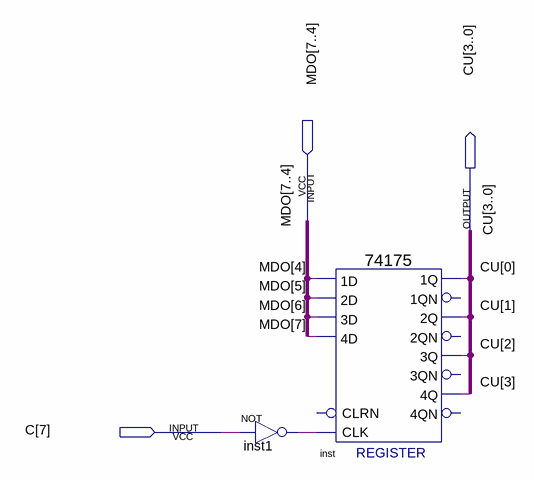
[diagram p0: schematic sheet]
// Quartus schematic IR.bdf as structural Verilog: 2 symbols, 3 pins
module IR (
  input  [7:4] MDO,
  input  [7:7] C,
  output [3:0] CU
);

  wire inst1_out;

  not inst1 (inst1_out, C[7]);
  \74175  inst (
    .CLK(inst1_out), .\3D (MDO[6]), .\2D (MDO[5]), .\1D (MDO[4]), .\4D (MDO[7]), .\1Q (CU[0]), .\3Q (CU[2]),
    .\2Q (CU[1]), .\4Q (CU[3]));  // open: CLRN, 1QN, 2QN, 4QN, 3QN
endmodule
